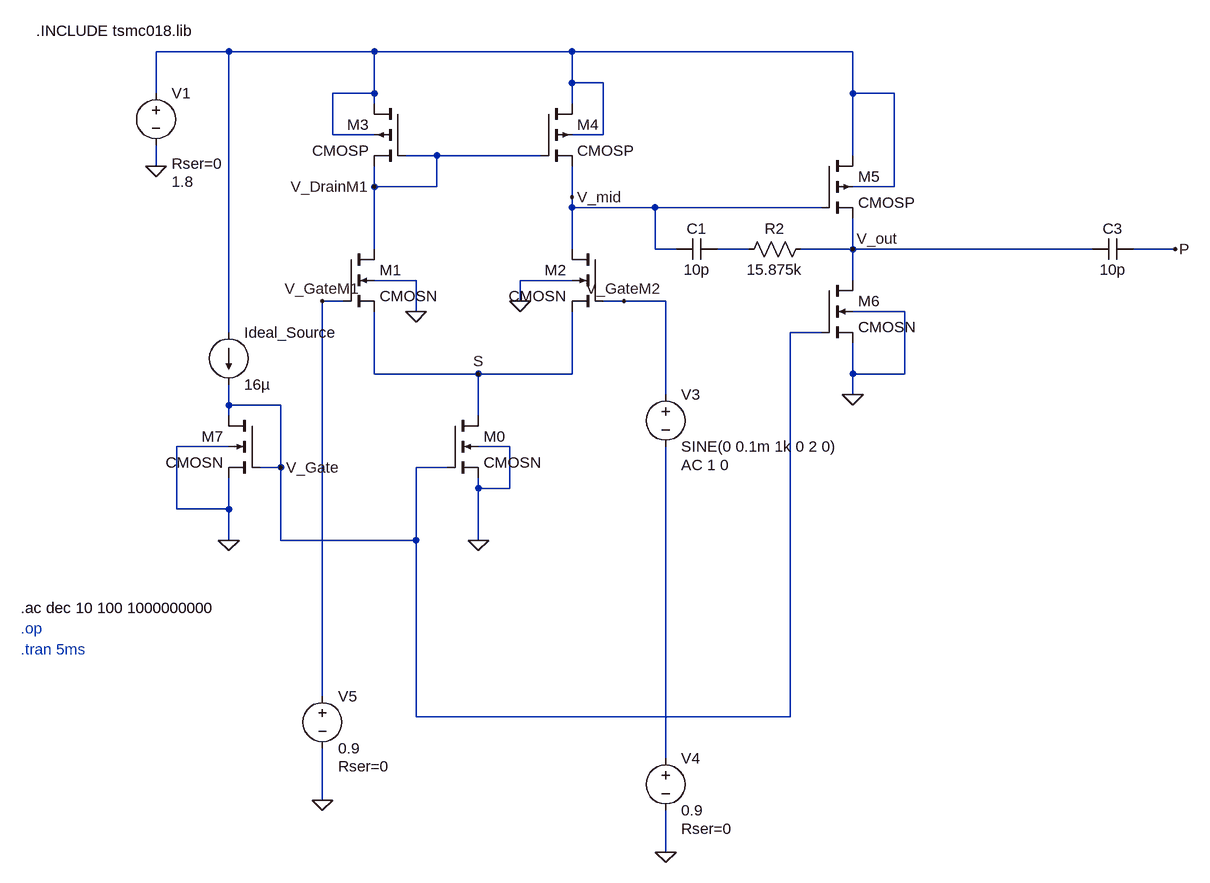
[diagram p0: schematic 2_Stage_OTA_PranavVishalDeshmukh_230102073_Open_Loop 1.asc]
2_Stage_OTA_PranavVishalDeshmukh_230102073_Open_Loop 1.asc, the LTspice schematic file:
Version 4
SHEET 1 1524 1316
WIRE -128 -32 -240 -32
WIRE 96 -32 -128 -32
WIRE 400 -32 96 -32
WIRE 832 -32 400 -32
WIRE 400 16 400 -32
WIRE 448 16 400 16
WIRE -240 32 -240 -32
WIRE 96 32 96 -32
WIRE 96 32 32 32
WIRE 832 32 832 -32
WIRE 896 32 832 32
WIRE 96 48 96 32
WIRE 400 48 400 16
WIRE 32 96 32 32
WIRE 96 96 32 96
WIRE 448 96 448 16
WIRE 448 96 400 96
WIRE 192 128 144 128
WIRE 352 128 192 128
WIRE 832 128 832 32
WIRE -240 144 -240 112
WIRE 96 176 96 144
WIRE 192 176 192 128
WIRE 192 176 96 176
WIRE 896 176 896 32
WIRE 896 176 832 176
WIRE 400 192 400 144
WIRE 400 208 400 192
WIRE 528 208 400 208
WIRE 784 208 528 208
WIRE 96 272 96 176
WIRE 400 272 400 208
WIRE 528 272 528 208
WIRE 560 272 528 272
WIRE 672 272 624 272
WIRE 832 272 832 224
WIRE 832 272 752 272
WIRE 1200 272 832 272
WIRE 1328 272 1264 272
WIRE 160 320 96 320
WIRE 400 320 320 320
WIRE 832 320 832 272
WIRE 48 352 16 352
WIRE 320 352 320 320
WIRE 480 352 448 352
WIRE 544 352 480 352
WIRE 160 368 160 320
WIRE 912 368 832 368
WIRE -128 400 -128 -32
WIRE 784 400 736 400
WIRE 96 464 96 368
WIRE 256 464 96 464
WIRE 400 464 400 368
WIRE 400 464 256 464
WIRE 832 464 832 416
WIRE 912 464 912 368
WIRE 912 464 832 464
WIRE 544 496 544 352
WIRE 832 496 832 464
WIRE -128 512 -128 480
WIRE -48 512 -128 512
WIRE -128 528 -128 512
WIRE 256 528 256 464
WIRE -128 576 -208 576
WIRE 304 576 256 576
WIRE -48 608 -48 512
WIRE -48 608 -80 608
WIRE 208 608 160 608
WIRE 256 640 256 624
WIRE 304 640 304 576
WIRE 304 640 256 640
WIRE -208 672 -208 576
WIRE -128 672 -128 624
WIRE -128 672 -208 672
WIRE -128 720 -128 672
WIRE -48 720 -48 608
WIRE 160 720 160 608
WIRE 160 720 -48 720
WIRE 256 720 256 640
WIRE 16 960 16 352
WIRE 160 992 160 720
WIRE 736 992 736 400
WIRE 736 992 160 992
WIRE 544 1056 544 576
WIRE 16 1120 16 1040
WIRE 544 1200 544 1136
FLAG -240 144 0
FLAG -128 720 0
FLAG 256 720 0
FLAG 256 464 S
FLAG 160 368 0
FLAG 320 352 0
FLAG 400 192 V_mid
FLAG 480 352 V_GateM2
FLAG 96 176 V_DrainM1
FLAG -48 608 V_Gate
FLAG 832 496 0
FLAG 832 272 V_out
FLAG 16 352 V_GateM1
FLAG 1328 272 P
FLAG 544 1200 0
FLAG 16 1120 0
DATAFLAG 1328 272 ""
DATAFLAG 288 464 ""
SYMBOL cmosp 352 48 R0
SYMATTR InstName M4
SYMATTR Value2 l=900n w=9000n
SYMBOL voltage -240 16 R0
WINDOW 3 24 152 Left 2
WINDOW 123 0 0 Left 0
WINDOW 39 24 124 Left 2
SYMATTR Value 1.8
SYMATTR SpiceLine Rser=0
SYMATTR InstName V1
SYMBOL cmosn 48 272 R0
SYMATTR InstName M1
SYMATTR Value2 l=900n w=62600n
SYMBOL cmosn 208 528 R0
SYMATTR InstName M0
SYMATTR Value2 l=900n w=32000n
SYMBOL current -128 400 R0
WINDOW 123 0 0 Left 0
WINDOW 39 0 0 Left 0
SYMATTR InstName Ideal_Source
SYMATTR Value 16µ
SYMBOL cmosp 144 48 M0
SYMATTR InstName M3
SYMATTR Value2 l=900n w=9000n
SYMBOL cmosn 448 272 M0
SYMATTR InstName M2
SYMATTR Value2 l=900n w=62600n
SYMBOL voltage 544 480 R0
WINDOW 123 24 124 Left 2
WINDOW 39 0 0 Left 0
SYMATTR Value2 AC 1 0
SYMATTR InstName V3
SYMATTR Value SINE(0 0.1m 1k 0 2 0)
SYMBOL cmosn -80 528 M0
SYMATTR InstName M7
SYMATTR Value2 l=900n w=3200n
SYMBOL cmosp 784 128 R0
SYMATTR InstName M5
SYMATTR Value2 l=900n w=2.15u
SYMBOL cmosn 784 320 R0
SYMATTR InstName M6
SYMATTR Value2 l=900n w=3.6u
SYMBOL cap 1264 256 R90
WINDOW 0 0 32 VBottom 2
WINDOW 3 32 32 VTop 2
SYMATTR InstName C3
SYMATTR Value 10p
SYMBOL voltage 544 1040 R0
WINDOW 123 0 0 Left 0
WINDOW 39 24 124 Left 2
SYMATTR SpiceLine Rser=0
SYMATTR InstName V4
SYMATTR Value 0.9
SYMBOL voltage 16 944 R0
WINDOW 123 0 0 Left 0
WINDOW 39 24 124 Left 2
SYMATTR SpiceLine Rser=0
SYMATTR InstName V5
SYMATTR Value 0.9
SYMBOL cap 624 256 R90
WINDOW 0 0 32 VBottom 2
WINDOW 3 32 32 VTop 2
SYMATTR InstName C1
SYMATTR Value 10p
SYMBOL res 768 256 R90
WINDOW 0 0 56 VBottom 2
WINDOW 3 32 56 VTop 2
SYMATTR InstName R2
SYMATTR Value 15.875k
TEXT -424 -64 Left 2 !.INCLUDE tsmc018.lib
TEXT -448 888 Left 2 ;.tran 5ms
TEXT -448 856 Left 2 ;.op
TEXT -448 824 Left 2 !.ac dec 10 100 1000000000

The netlist it stands for:
* 2_Stage_OTA_PranavVishalDeshmukh_230102073_Open_Loop 1.asc
M4 N001 V_DrainM1 V_mid N001 CMOSP l=900n w=9000n
V1 N001 0 1.8 Rser=0
M1 V_DrainM1 V_GateM1 S 0 CMOSN l=900n w=62600n
M0 S V_Gate 0 0 CMOSN l=900n w=32000n
Ideal_Source N001 V_Gate 16µ
M3 N001 V_DrainM1 V_DrainM1 N001 CMOSP l=900n w=9000n
M2 V_mid V_GateM2 S 0 CMOSN l=900n w=62600n
V3 V_GateM2 N003 SINE(0 0.1m 1k 0 2 0) AC 1 0
M7 V_Gate V_Gate 0 0 CMOSN l=900n w=3200n
M5 N001 V_mid V_out N001 CMOSP l=900n w=2.15u
M6 V_out V_Gate 0 0 CMOSN l=900n w=3.6u
C3 P V_out 10p
V4 N003 0 0.9 Rser=0
V5 V_GateM1 0 0.9 Rser=0
C1 N002 V_mid 10p
R2 V_out N002 15.875k
.model NMOS NMOS
.model PMOS PMOS
.lib standard.mos
.INCLUDE tsmc018.lib
* .tran 5ms
* .op
.ac dec 10 100 1000000000
.backanno
.end